# Altium schematic sheet Pannel_PB_LED.SchDoc
size A4
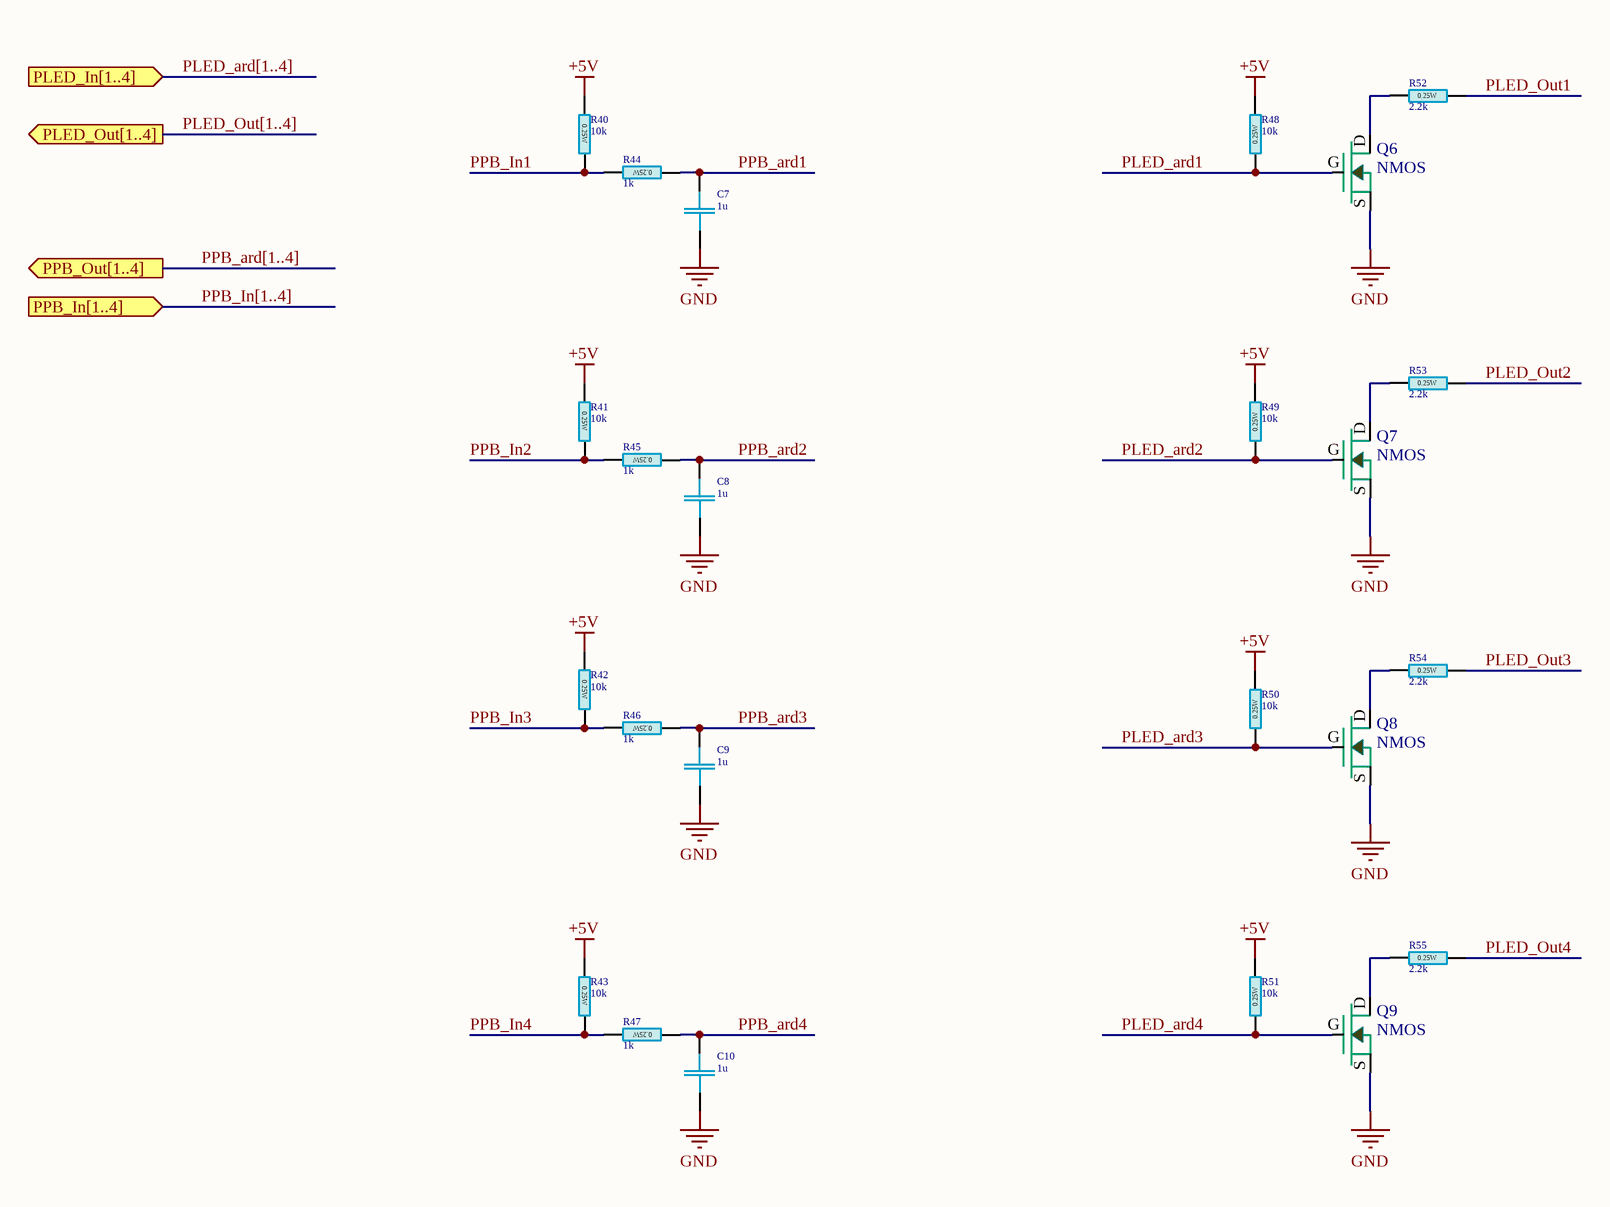
[diagram p0: Pannel_PB_LED.SchDoc]

## Parts
C7  1u  [C1206]
C8  1u  [C1206]
C9  1u  [C1206]
C10  1u  [C1206]
Q6  NMOS  [NMOS SOT-23]
Q7  NMOS  [NMOS SOT-23]
Q8  NMOS  [NMOS SOT-23]
Q9  NMOS  [NMOS SOT-23]
R40  10k  [R1206]
R41  10k  [R1206]
R42  10k  [R1206]
R43  10k  [R1206]
R44  1k  [R1206]
R45  1k  [R1206]
R46  1k  [R1206]
R47  1k  [R1206]
R48  10k  [R1206]
R49  10k  [R1206]
R50  10k  [R1206]
R51  10k  [R1206]
R52  2.2k  [R1206]
R53  2.2k  [R1206]
R54  2.2k  [R1206]
R55  2.2k  [R1206]

## Ports
PLED_In[1..4] (in), PLED_Out[1..4] (out), PPB_In[1..4] (in), PPB_Out[1..4] (out)

## Nets
+5V: R40.1 R41.1 R42.1 R43.1 R48.2 R49.2 R50.2 R51.2
GND: C7.2 C8.2 C9.2 C10.2 Q6.S Q7.S Q8.S Q9.S
PLED_ard1: Q6.G R48.1
PLED_ard2: Q7.G R49.1
PLED_ard3: Q8.G R50.1
PLED_ard4: Q9.G R51.1
PLED_Out1: R52.2
PLED_Out2: R53.2
PLED_Out3: R54.2
PLED_Out4: R55.2
PPB_ard1: C7.1 R44.1
PPB_ard2: C8.1 R45.1
PPB_ard3: C9.1 R46.1
PPB_ard4: C10.1 R47.1
PPB_In1: R40.2 R44.2
PPB_In2: R41.2 R45.2
PPB_In3: R42.2 R46.2
PPB_In4: R43.2 R47.2
NetQ6_D: Q6.D R52.1
NetQ7_D: Q7.D R53.1
NetQ8_D: Q8.D R54.1
NetQ9_D: Q9.D R55.1

## Buses and harness runs
bus PLED_ard[1..4] = port PLED_In[1..4]
bus PLED_Out[1..4] = port PLED_Out[1..4]
bus PPB_ard[1..4] = port PPB_Out[1..4]
bus PPB_In[1..4] = port PPB_In[1..4]

## Library data of the parts
C7-C10 = C 1206  100V X7R - 100n: SMD 1206   100V X7R 10%; Part Number: CL31B104KCFNNNE; Manufacturer: Samsung; TYPE: Capacitors; Package-mm: 3216; Mount Type: SMT; Publisher: Hefest; Manufacturer Alternate: *; Part Number Alternate: *; Published: 07.04.2019; Supplier 1: Comet; Supplier Part Number 1: C1206 100nF 100V X7R SAMSUNG; RoHS: Y; Technology: Ceramic  MLCC; Package: 1206; VDC: 100V; TempCo: X7R; Tolerance %: ±10%; VAC: *; ESR Ohm: *; ComponentLink1Description: Datasheet Link; ComponentLink1URL: https://store.comet.bg/download-file.php?id=11; Temperature Range: -55°C ~ +125°C; Price: 0.090; ComponentLink2Description: Characteristics data; ComponentLink2URL: https://store.comet.bg/download-file.php?id=3821; Value: 1u
R40-R55 = R 1206-5%: SMD 1206 0.25W   5% 200V; Manufacturer: YAGEO; TempCo: ±100ppm/°C; Package-mm: 3216; Value Code: 102; Part Number: *; Mount Type: SMT; Publisher: Hefest; Manufacturer Alternate: *; Published: 07.04.2019; Supplier 1: Comet; Supplier Part Number 1: R1206 1.0K 5% YAG/ASJ; RoHS: Y; Technology: Thick film; Package: 1206; VDC: 200V; Tolerance %: ±5%; ComponentLink1Description: Datasheet Link; ComponentLink1URL: https://store.comet.bg/download-file.php?id=140; Temperature Range: -55°C ~ +155°C; Price: 0.054; Part Number Alternate: *; TYPE: Resistor; Power: 0.25W
  R40-R43 R48-R51: Value: 10k
  R44-R47: Value: 1k
  R52-R55: Value: 2.2k